# Altium schematic sheet Sheet2.SchDoc
size A; Engineer: MISSAL; SheetNumber: 1; SheetTotal: 1
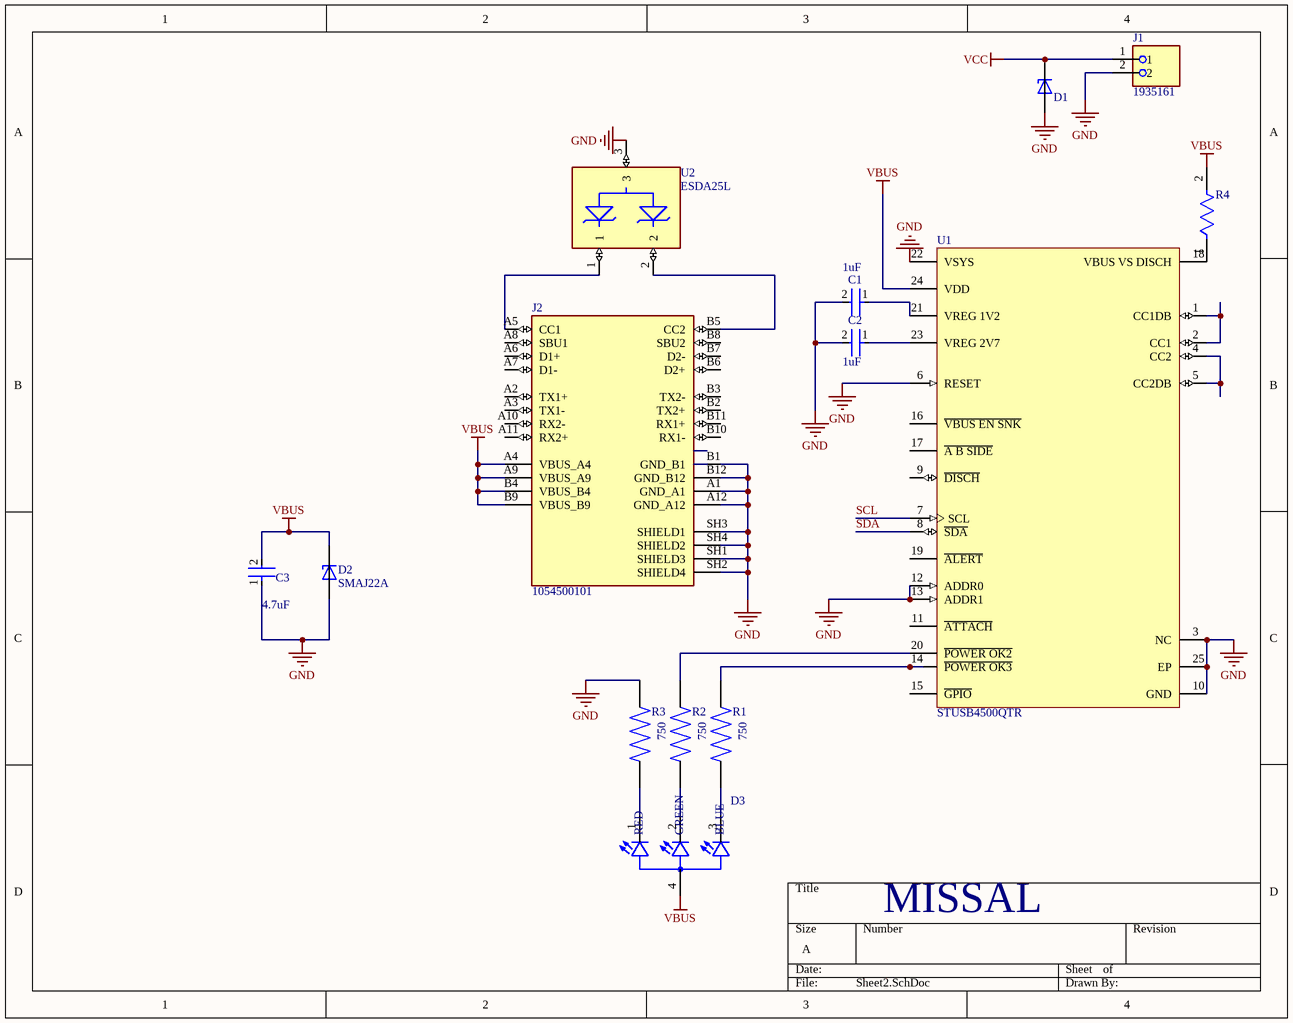
[diagram p0: Sheet2.SchDoc]

## Parts
C1  Capacitance: 1uF  [FP-CL10-IPC_C]  (hidden comment: CL10B105KP8NNNC)
C2  Capacitance: 1uF  [FP-CL10-IPC_C]  (hidden comment: CL10B105KP8NNNC)
C3  Capacitance: 4.7uF  [FP-GRM188-0_15-IPC_C]  (hidden comment: GRM188R61E475KE11D)
D1  SMAJ22A  [DIOM4325X250N]  (value not drawn)
D2  SMAJ22A  [DIOM4325X250N]
D3  19-237/R6GHBHC-A01/2T  [LED_19-237/R6GHBHC-A01/2T]  (value not drawn)
J1  1935161  [PHOENIX_1935161]
J2  1054500101  [MOLEX_1054500101]
R1  value 750  [RES_ERJP06J751V]  (hidden comment: ERJP06J751V)
R2  value 750  [RES_ERJP06J751V]  (hidden comment: ERJP06J751V)
R3  value 750  [RES_ERJP06J751V]  (hidden comment: ERJP06J751V)
R4  RMCF0603FG1K00  [FP-RMCF0603-IPC_B]  (value not drawn)
U1  STUSB4500QTR  [FP-QFN-24-EP_4x4-MFG]
U2  ESDA25L  [SOT-23-3L]

## Nets
GND: C1.2 C2.2 C3.1 D1.A D2.A J1.2 J2.A1(GND_A1) J2.A12(GND_A12) J2.B1(GND_B1) J2.B12(GND_B12) J2.SH1(SHIELD3) J2.SH2(SHIELD4) J2.SH3(SHIELD1) J2.SH4(SHIELD2) R3.2 U1.3(NC) U1.6(RESET) U1.10(GND) U1.12(ADDR0) U1.13(ADDR1) U1.22(VSYS) U1.25(EP) U2.3
VBUS: C3.2 D2.C D3.4(A) J2.A4(VBUS_A4) J2.A9(VBUS_A9) J2.B4(VBUS_B4) J2.B9(VBUS_B9) R4.2 U1.24(VDD)
VCC: D1.C J1.1
SCL: U1.7(SCL)
SDA: U1.8(~{SDA})
NetC1_1: C1.1 U1.21(VREG_1V2)
NetC2_1: C2.1 U1.23(VREG_2V7)
NetD3_1: D3.1(R_C) R3.1
NetD3_2: D3.2(G_C) R2.1
NetD3_3: D3.3(B_C) R1.1
NetJ2_A5: J2.A5(CC1) U2.1
NetJ2_B5: J2.B5(CC2) U2.2
NetR1_2: R1.2 U1.14(~{POWER_OK3})
NetR2_2: R2.2 U1.20(~{POWER_OK2})
NetR4_1: R4.1 U1.18(VBUS_VS_DISCH)
NetU1_1: U1.1(CC1DB) U1.2(CC1)
NetU1_4: U1.4(CC2) U1.5(CC2DB)

Not connected (* = marked no-connect by the designer): J2 A2(TX1+) A3(TX1-) A6(D1+) A7(D1-) A8(SBU1) A10(RX2-) A11(RX2+) B2(TX2+) B3(TX2-) B6(D2+) B7(D2-) B8(SBU2) B10(RX1-) B11(RX1+); U1 9(~{DISCH}) 11(~{ATTACH}) 15(~{GPIO}) 16(~{VBUS_EN_SNK}) 17(~{A_B_SIDE}) 19(~{ALERT})

## Notes on the sheet
- (in symbol 19-237/R6GHBHC-A01/2T) RED; GREEN; BLUE

## Library data of the parts
C1 C2 = CMP-2000-06094-2: Cap Ceramic 1uF 10V X7R ±10% Pad SMD 0603 +125°C T/R; Packaging: Tape and Reel; Depth: 0.8mm; Voltage Rating: 10V; Lead Free: Lead Free; Radiation Hardening: No; Length: 1.6mm; Package Quantity: 1; Mount: Surface Mount; Case/Package: 0603; Max Operating Temperature: 125°C; Case Code (Metric): 1608; Height: 0.8mm; Min Operating Temperature: -55°C; Dielectric: X7R; Contact Plating: Tin; Case Code (Imperial): 0603; Thickness: 0.035inch; Voltage Rating (DC): 10V; Tolerance: 10%; Width: 0.031inch
C3 = CMP-2006-02523-2: Chip Multilayer Ceramic Capacitors for General Purpose, 0603, 4.7uF, X5R, 15%, 10%, 25V; Case Code (Metric): 1608; Max Operating Temperature: 85°C; REACH SVHC: No SVHC; Voltage Rating: 25V; Dielectric: X5R; Packaging: Cut Tape; Width: 0.031inch; Min Operating Temperature: -55°C; Lead Free: Lead Free; Height: 0.8mm; Case Code (Imperial): 0603; Length: 1.6mm; Voltage Rating (DC): 25V; Case/Package: 0603; Voltage: 25V; Tolerance: 10%; Thickness: 0.031inch; Mount: Surface Mount; Material: Ceramic; Package Quantity: 4000; Depth: 0.8mm
D1 D2 = SMAJ22A: SMAJ Series 35.5 V 0.4 kW Surface Mount Uni-Directional TVS Diode - DO-214AC; MF: Littelfuse; MP: SMAJ22A; Purchase-URL: https://pricing.snapeda.com/search/part/SMAJ22A/?ref=eda; SnapEDA_Link: https://www.snapeda.com/parts/SMAJ22A/Littelfuse/view-part/?ref=snap; Value: *; Package: DO-214 Littelfuse; Price: None; Availability: In Stock; Check_prices: https://www.snapeda.com/parts/SMAJ22A/Littelfuse/view-part/?ref=eda
D3 = 19-237/R6GHBHC-A01/2T: Red, Green, Blue (RGB) 624nm Red, 525nm Green, 470nm Blue LED Indication - Discrete 2V Red, 3.3V Green, 3.3V Blue 2-SMD, No Lead; MF: Everlight Electronics; Package: SMD-2 Everlight Electronics; Price: None; Check_prices: https://www.snapeda.com/parts/19-237/R6GHBHC-A01/2T/Everlight+Electronics+Co+Ltd/view-part/?ref=eda; Value: *; SnapEDA_Link: https://www.snapeda.com/parts/19-237/R6GHBHC-A01/2T/Everlight+Electronics+Co+Ltd/view-part/?ref=snap; MP: 19-237/R6GHBHC-A01/2T; Availability: In Stock; Purchase-URL: https://pricing.snapeda.com/search/part/19-237/R6GHBHC-A01/2T/?ref=eda
J1 = 1935161: MF: {'manufacturer': u'Phoenix Contact'}; Package: None; Price: None; Value: *; MP: 1935161; Availability: Unavailable
J2 = 1054500101: USB-C (USB TYPE-C) USB 3.2 Gen 2 (USB 3.1 Gen 2, Superspeed + (USB 3.1)) Receptacle Connector 24 Position Surface Mount, Right Angle; Through Hole; MF: Molex; SnapEDA_Link: https://www.snapeda.com/parts/1054500101/Molex/view-part/?ref=snap; Package: None; Value: *; MP: 1054500101; Check_prices: https://www.snapeda.com/parts/1054500101/Molex/view-part/?ref=eda
R4 = CMP-26527-003160-1: 1kΩ ±1% 0.1W 0603 Thick Film Chip Resistor AEC-Q200 compliant; Max Power Dissipation: 100mW; Temperature Coefficient: 100ppm/°C; Resistance: 1kR; Radiation Hardening: No; Case Code (Metric): 1608; Length: 0.061inch; Series: RMCF; Resistor Type: Thick Film; Tolerance: 1%; Height: 0.022inch; Mount: Surface Mount; Number of Terminations: 2; Max Operating Temperature: 155°C; Min Operating Temperature: -55°C; Lead Free: Lead Free; Case/Package: 0603; Contact Plating: Tin; Packaging: Tape and Reel; RoHS Compliant: Yes; Width: 0.031inch; Case Code (Imperial): 0603; Features: Automotive AEC-Q200
U1 = CMP-12113-000003-3: 4.1V~22V USB 2.0 I2C Controllers Interface ICs STUSB45 Controller 24-VFQFN Exposed Pad; Number of Ports: 1; Min Supply Voltage: 3V; Max Junction Temperature (Tj): 145°C; Max Supply Voltage: 22V; Interface: I2C, USB; USB Standard: USB 2.0; Lifecycle Status: Production; Schedule B: 8542390000, 8542390000; Min Operating Temperature: -40°C; Ambient Temperature Range High: 105°C; Max Operating Temperature: 105°C; Height: 1mm
U2 = ESDA25L: - Clamp - Ipp Tvs Diode Surface Mount SOT-23-3; MF: STMicroelectronics; Package: SOT-23-3 STMicroelectronics; Price: None; Check_prices: https://www.snapeda.com/parts/ESDA25L/STMicroelectronics/view-part/?ref=eda; Value: *; SnapEDA_Link: https://www.snapeda.com/parts/ESDA25L/STMicroelectronics/view-part/?ref=snap; MP: ESDA25L; Availability: In Stock; Purchase-URL: https://pricing.snapeda.com/search?q=ESDA25L&ref=eda
R1-R3 = ERJP06J751V: Availability: Unavailable; MP: ERJP06J751V; Price: None; Package: None